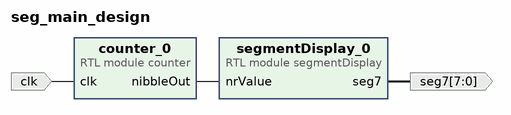
[diagram p0: block diagram of the top level]
# Vivado block design seg_main_design, xc7a35tcpg236-1, Vivado 2019.1.2
create_bd_design seg_main_design

create_bd_port -dir I -type clk clk
set_property -dict {CONFIG.FREQ_HZ 12000000} [get_bd_ports clk]
create_bd_port -dir O -from 7 -to 0 seg7

create_bd_cell -type module -reference counter counter_0
create_bd_cell -type module -reference segmentDisplay segmentDisplay_0

# ---- connections ----

connect_bd_net [get_bd_pins counter_0/nibbleOut] [get_bd_pins segmentDisplay_0/nrValue]
connect_bd_net [get_bd_ports clk] [get_bd_pins counter_0/clk]
connect_bd_net [get_bd_pins segmentDisplay_0/seg7] [get_bd_ports seg7]

validate_bd_design
save_bd_design
